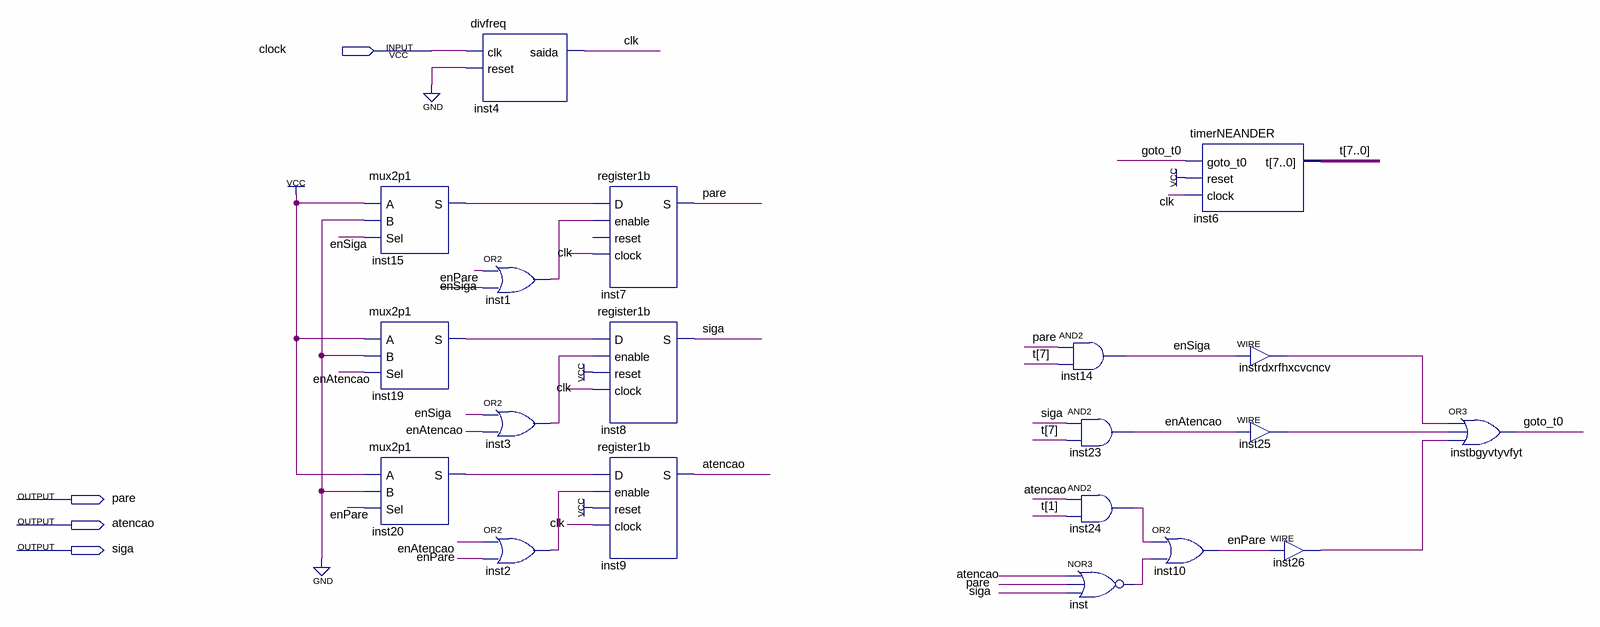
[diagram p0: schematic sheet]
// Quartus schematic lab10.bdf as structural Verilog: 20 symbols, 4 pins
module lab10 (
  input  clock,
  output pare,
  output atencao,
  output siga
);

  wire clk, enAtencao, enPare, enSiga, goto_t0, inst1_out, inst2_out, inst3_out, inst15_s, inst19_s,
       inst20_s, inst24_out, inst25_out, inst26_out, inst_out, instrdxrfhxcvcncv_out;
  wire [7:0] t;

  mux2p1 inst15 (.A(1'b1), .B(1'b0), .Sel(enSiga), .S(inst15_s));
  mux2p1 inst19 (.A(1'b1), .B(1'b0), .Sel(enAtencao), .S(inst19_s));
  mux2p1 inst20 (.A(1'b1), .B(1'b0), .Sel(enPare), .S(inst20_s));
  divfreq inst4 (.clk(clock), .reset(1'b0), .saida(clk));
  or inst1 (inst1_out, enPare, enSiga);
  or inst3 (inst3_out, enSiga, enAtencao);
  or inst2 (inst2_out, enAtencao, enPare);
  register1b inst7 (.D(inst15_s), .enable(inst1_out), .clock(clk), .S(pare));  // open: reset
  register1b inst8 (.D(inst19_s), .enable(inst3_out), .reset(1'b1), .clock(clk), .S(siga));
  register1b inst9 (.D(inst20_s), .enable(inst2_out), .reset(1'b1), .clock(clk), .S(atencao));
  and inst14 (enSiga, pare, t[7]);
  and inst23 (enAtencao, siga, t[7]);
  and inst24 (inst24_out, atencao, t[1]);
  nor inst (inst_out, atencao, pare, siga);
  timerNEANDER inst6 (.goto_t0(goto_t0), .reset(1'b1), .clock(clk), .t(t));
  or inst10 (enPare, inst24_out, inst_out);
  assign instrdxrfhxcvcncv_out = enSiga;  // WIRE instrdxrfhxcvcncv
  assign inst25_out = enAtencao;  // WIRE inst25
  assign inst26_out = enPare;  // WIRE inst26
  or instbgyvtyvfyt (goto_t0, instrdxrfhxcvcncv_out, inst25_out, inst26_out);
endmodule
